# EAGLE design Timer-Ruler (EAGLE 7.5.0)
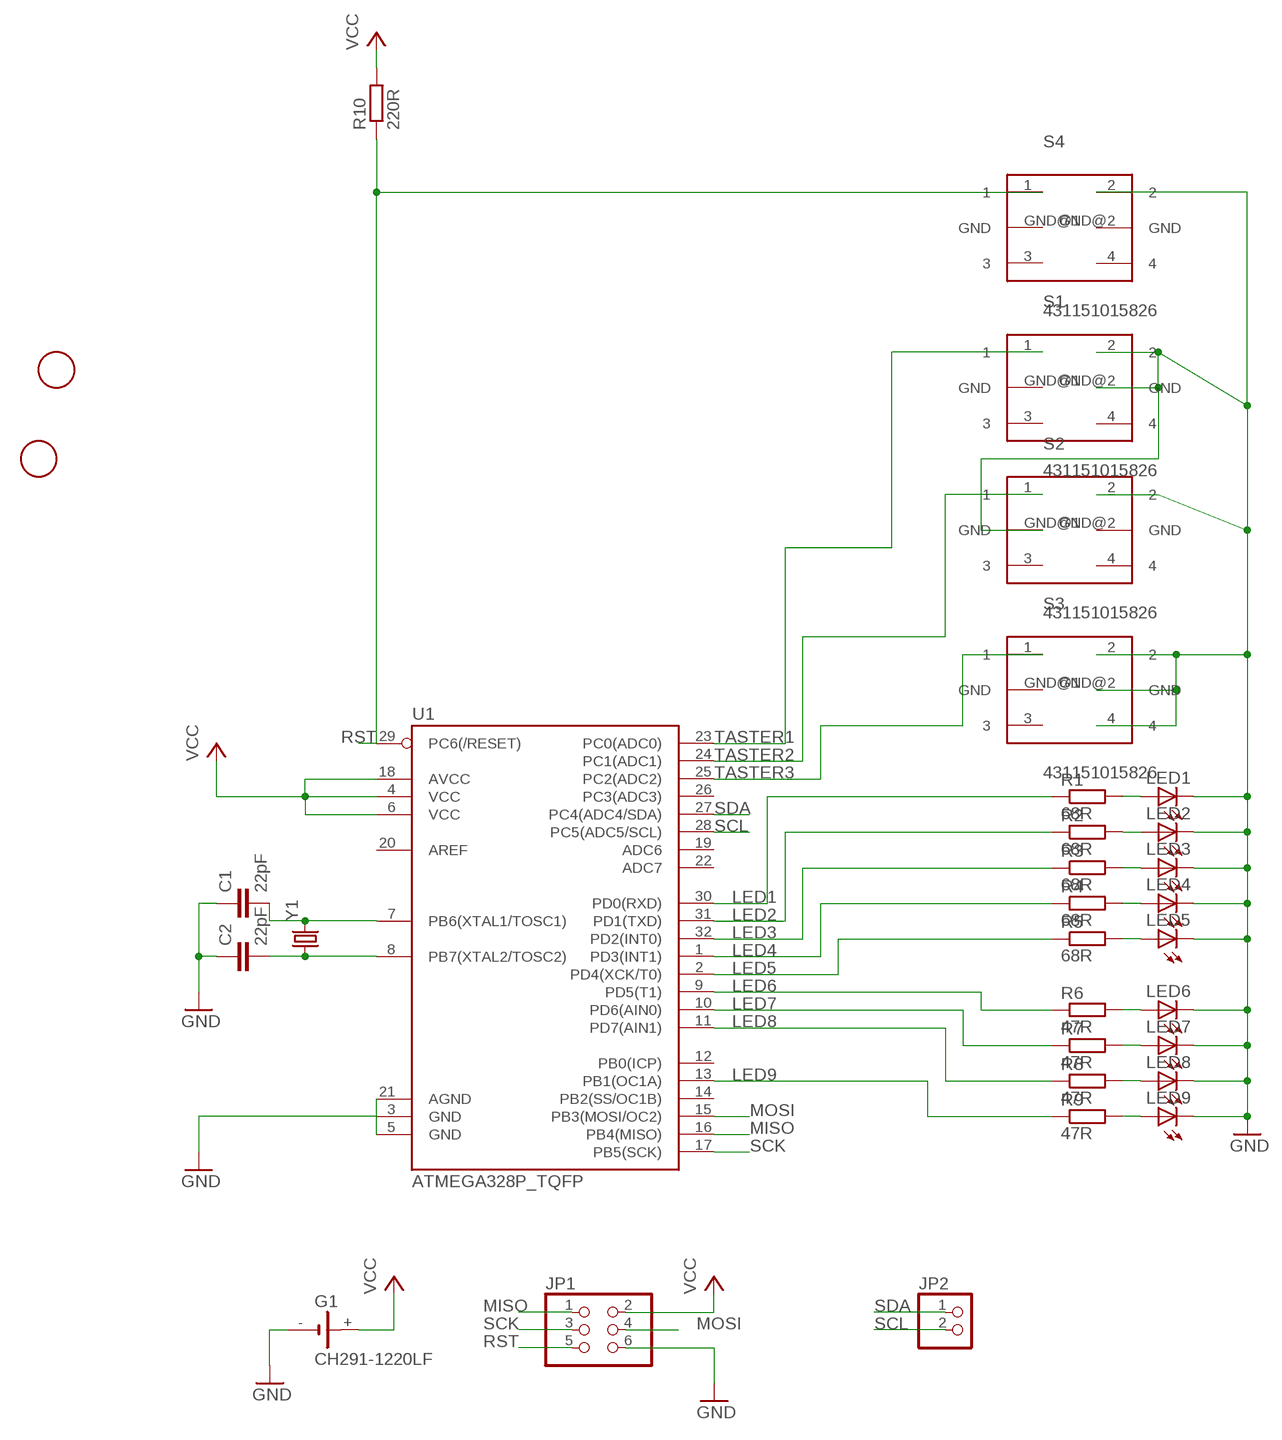
[diagram p0: schematic, sheet 1]

## Parts
C1  22pF  C-EUC0603  [C0603]
C2  22pF  C-EUC0603  [C0603]
G1  CH291-1220LF  [CH291-1220LF]
JP1  PINHD-2X3  [2X03]
JP2  PINHD-1X2  [1X02]
LED1  LEDCHIP-LED0805  [CHIP-LED0805]
LED2  LEDCHIP-LED0805  [CHIP-LED0805]
LED3  LEDCHIP-LED0805  [CHIP-LED0805]
LED4  LEDCHIP-LED0805  [CHIP-LED0805]
LED5  LEDCHIP-LED0805  [CHIP-LED0805]
LED6  LEDCHIP-LED0805  [CHIP-LED0805]
LED7  LEDCHIP-LED0805  [CHIP-LED0805]
LED8  LEDCHIP-LED0805  [CHIP-LED0805]
LED9  LEDCHIP-LED0805  [CHIP-LED0805]
R1  68R  R-EU_R0603  [R0603]
R2  68R  R-EU_R0603  [R0603]
R3  68R  R-EU_R0603  [R0603]
R4  68R  R-EU_R0603  [R0603]
R5  68R  R-EU_R0603  [R0603]
R6  47R  R-EU_R0603  [R0603]
R7  47R  R-EU_R0603  [R0603]
R8  47R  R-EU_R0603  [R0603]
R9  47R  R-EU_R0603  [R0603]
R10  220R  R-EU_R0603  [R0603]
S1  431151015826  [431181015816]
S2  431151015826  [431181015816]
S3  431151015826  [431181015816]
S4  431151015826  [431181015816]
U1  ATMEGA328P_TQFP  [TQFP32-08]
U$1  FIDUCIAL  [FIDUCIAL_1MM]
U$2  FIDUCIAL  [FIDUCIAL_1MM]
Y1  CRYSTALCRYSTAL-SMD-5X3-12.288MHZ  [CRYSTAL-SMD-5X3]

## Nets
GND: C1.1 C2.1 G1.- JP1.6 LED1.C LED2.C LED3.C LED4.C LED5.C LED6.C LED7.C LED8.C LED9.C S1.2 S1.GND@2(GND) S2.2 S2.GND@1(GND) S3.2 S3.4 S3.GND@2(GND) S4.2 U1.3(GND)
LED1: R1.1 U1.30(PD0(RXD))
LED2: R2.1 U1.31(PD1(TXD))
LED3: R3.1 U1.32(PD2(INT0))
LED4: R4.1 U1.1(PD3(INT1))
LED5: R5.1 U1.2(PD4(XCK/T0))
LED6: R6.1 U1.9(PD5(T1))
LED7: R7.1 U1.10(PD6(AIN0))
LED8: R8.1 U1.11(PD7(AIN1))
LED9: R9.1 U1.13(PB1(OC1A))
MISO: JP1.1 U1.16(PB4(MISO))
MOSI: JP1.4 U1.15(PB3(MOSI/OC2))
N$1: LED1.A R1.2
N$2: LED2.A R2.2
N$3: LED3.A R3.2
N$4: LED4.A R4.2
N$5: LED5.A R5.2
N$6: LED6.A R6.2
N$7: LED7.A R7.2
N$8: LED8.A R8.2
N$9: LED9.A R9.2
N$10: C1.2 U1.7(PB6(XTAL1/TOSC1)) Y1.3
N$12: C2.2 U1.8(PB7(XTAL2/TOSC2)) Y1.1
N$13: U1.5(GND) U1.21(AGND)
RST: JP1.5 R10.1 S4.1 U1.29(PC6(/RESET))
SCK: JP1.3 U1.17(PB5(SCK))
SCL: JP2.2 U1.28(PC5(ADC5/SCL))
SDA: JP2.1 U1.27(PC4(ADC4/SDA))
TASTER1: S1.1 U1.23(PC0(ADC0))
TASTER2: S2.1 U1.24(PC1(ADC1))
TASTER3: S3.1 U1.25(PC2(ADC2))
VCC: G1.+ JP1.2 R10.2 U1.4(VCC) U1.6(VCC) U1.18(AVCC)
Unconnected: S1.3 S1.4 S1.GND@1(GND) S2.3 S2.4 S2.GND@2(GND) S3.3 S3.GND@1(GND) S4.3 S4.4 S4.GND@1(GND) S4.GND@2(GND) U1.12(PB0(ICP)) U1.14(PB2(SS/OC1B)) U1.19(ADC6) U1.20(AREF) U1.22(ADC7) U1.26(PC3(ADC3))

## Library data of the parts
C1 C2 = resistor:C-EU: CAPACITOR, European symbol
G1 = battery:CH291-1220LF: Battery Holder, SMT, 12mm multicomp PART NO. CH291-1220LF Source: Data sheet <http://www.farnell.com/datasheets/1505860.pdf>
JP1 = pinhead:PINHD-2X3: PIN HEADER
JP2 = pinhead:PINHD-1X2: PIN HEADER
LED1-LED9 = led:LED: LED OSRAM: - CHIPLED LG R971, LG N971, LY N971, LG Q971, LY Q971, LO R971, LY R971 LH N974, LH R974 LS Q976, LO Q976, LY Q976 LO Q996 - Hyper CHIPLED LW Q18S LB Q993, LB Q99A, LB R99A - SideLED LS A670, LO A670, LY A670, LG A670, LP A670 LB A673, LV A673, LT A673, LW A673 LH A674 LY A675 LS A676, LA A676, LO A676, LY A676, LW A676 LS A679, LY A679, LG A679 - Hyper Micro SIDELED® LS Y876, LA Y876, LO Y876, LY Y876 LT Y87S - SmartLED LW L88C, LW L88S LB L89C, LB L89S, LG L890 LS L89K, LO L89K, LY L89K LS L896, LA L896, LO L896, LY L896 - TOPLED LS T670, LO T670, LY T670, LG T670, LP T670 LSG T670, LSP T670, LSY T670, LOP T670, LYG T670 LG T671, LOG T671, LSG T671 LB T673, LV T673, LT T673, LW T673 LH T674 LS T676, LA T676, LO T676, LY T676, LB T676, LH T676, LSB T676, LW T676 LB T67C, LV T67C, LT T67C, LS T67K, LO T67K, LY T67K, LW E67C LS E67B, LA E67B, LO E67B, LY E67B, LB E67C, LV E67C, LT E67C LW T67C LS T679, LY T679, LG T679 LS T770, LO T770, LY T770, LG T770, LP T770 LB T773, LV T773, LT T773, LW T773 LH T774 LS E675, LA E675, LY E675, LS T675 LS T776, LA T776, LO T776, LY T776, LB T776 LHGB T686 LT T68C, LB T68C - Hyper Mini TOPLED® LB M676 - Mini TOPLED Santana® LG M470 LS M47K, LO M47K, LY M47K Source: http://www.osram.convergy.de LUXEON: - LUMILED® LXK2-PW12-R00, LXK2-PW12-S00, LXK2-PW14-U00, LXK2-PW14-V00 LXK2-PM12-R00, LXK2-PM12-S00, LXK2-PM14-U00 LXK2-PE12-Q00, LXK2-PE12-R00, LXK2-PE12-S00, LXK2-PE14-T00, LXK2-PE14-U00 LXK2-PB12-K00, LXK2-PB12-L00, LXK2-PB12-M00, LXK2-PB14-N00, LXK2-PB14-P00, LXK2-PB14-Q00 LXK2-PR12-L00, LXK2-PR12-M00, LXK2-PR14-Q00, LXK2-PR14-R00 LXK2-PD12-Q00, LXK2-PD12-R00, LXK2-PD12-S00 LXK2-PH12-R00, LXK2-PH12-S00 LXK2-PL12-P00, LXK2-PL12-Q00, LXK2-PL12-R00 Source: www.luxeon.com KINGBRIGHT: KA-3528ASYC Source: www.kingbright.com
R1-R10 = resistor:R-EU_: RESISTOR, European symbol
S1-S4 = Wurth_Elektronik_Electromechanic_Switchs_rev15b:431151015826: WS-TSS-5x5 mm SMD Tact Switch with ground terminal, 4 pins
U1 = SparkFun-DigitalIC:ATMEGA328P_TQFP; PROD_ID: IC-09069
U$1 U$2 = adafruit:FIDUCIAL: For use by pick and place machines to calibrate the vision/machine, 1mm By microbuilder.eu
Y1 = SparkFun-FreqCtrl:CRYSTAL: Various standard crystals. Proven footprints.; PROD_ID: XTAL-09653

## Board
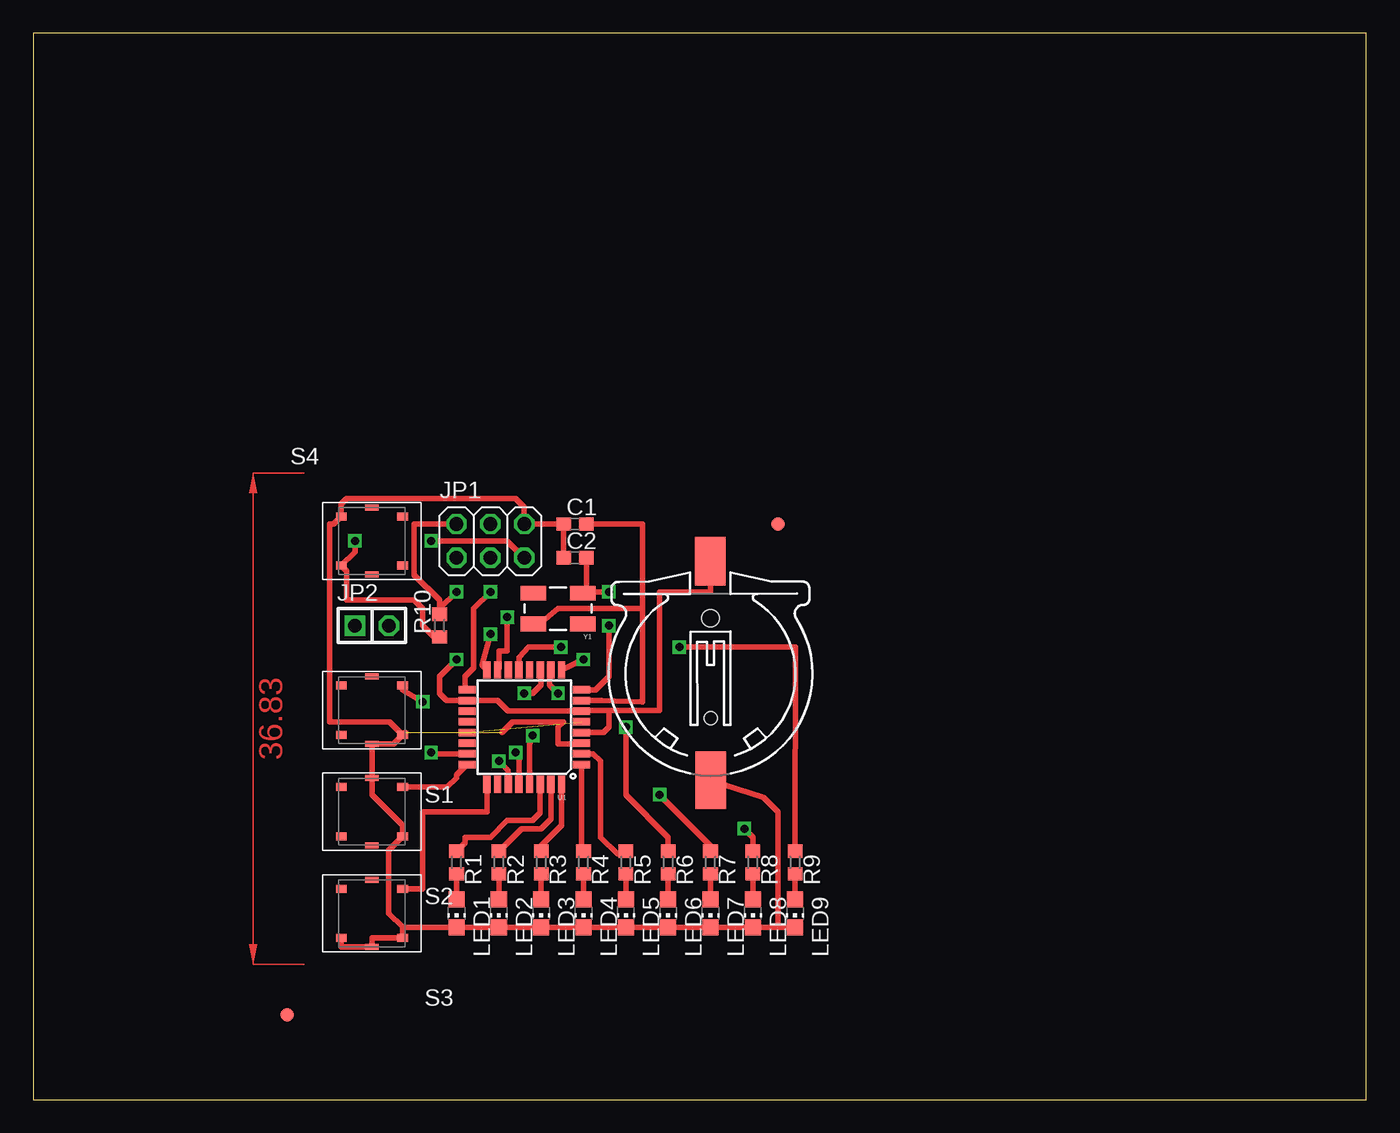
[diagram p1: board, top side]
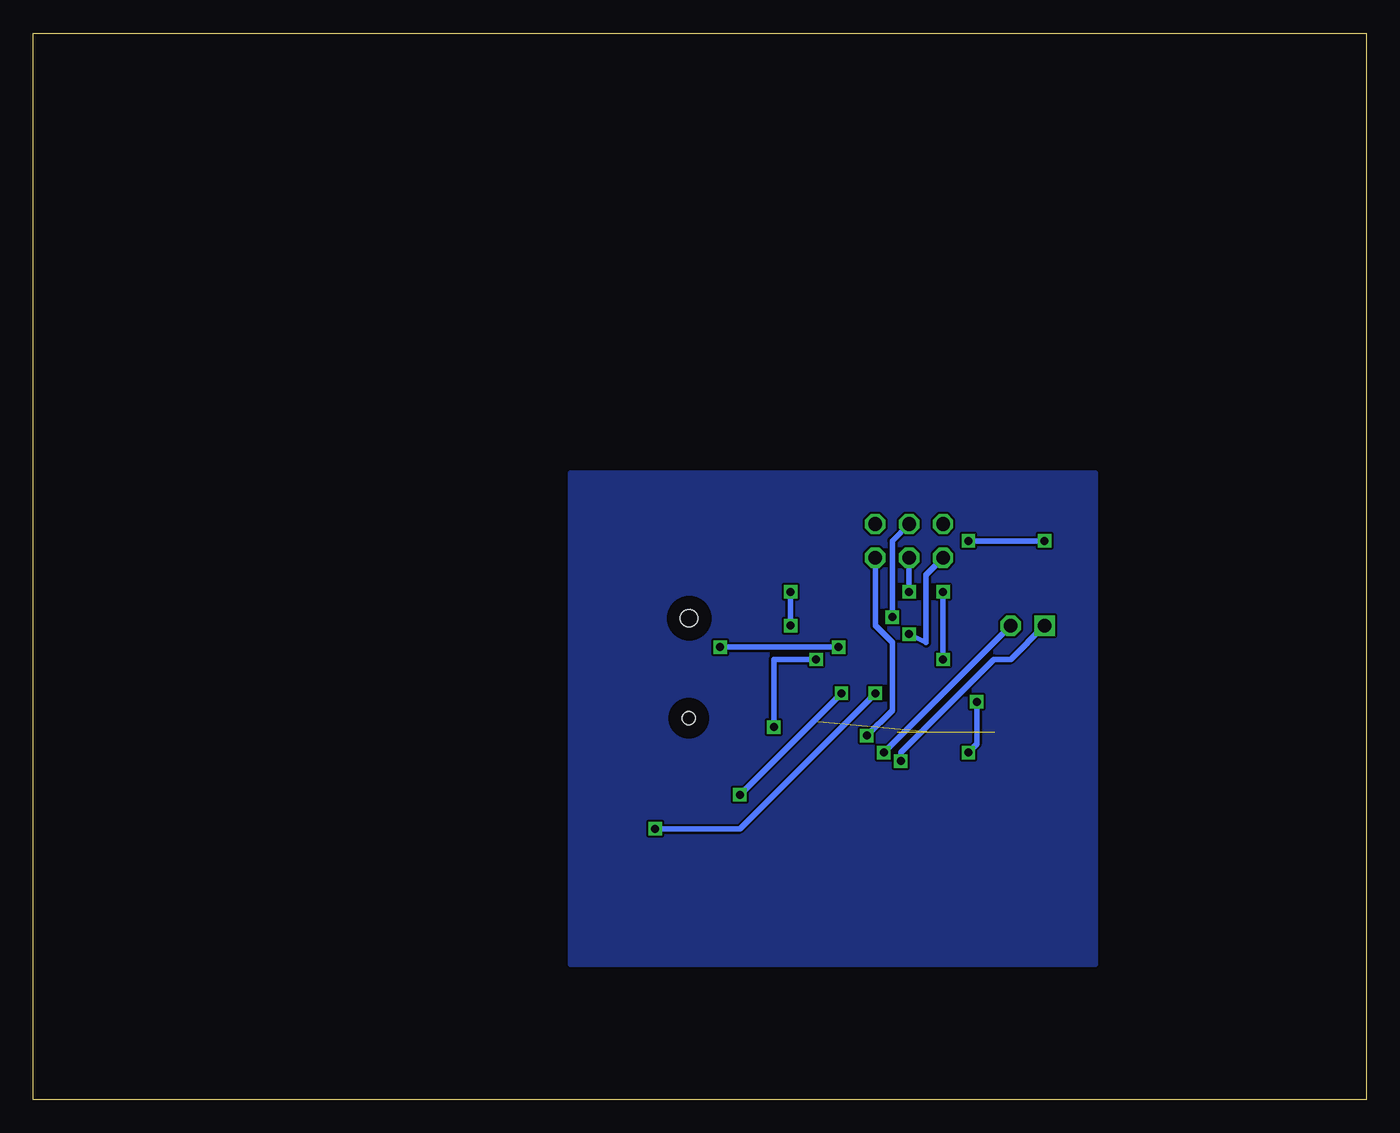
[diagram p2: board, bottom side, seen from below]

Size 100 x 80 mm. Coordinates in mm from the lower left corner, seen from the top.
Outline: 0,0 100,0 100,80 0,80 0,0
Copper layers (1*16): Top 0.035mm / dielectric 1.5mm / Bottom 0.035mm
Design rules "default *": minimum track width 0.4mm, minimum drill 0.4mm, track to track 7mil, track to pad 7mil, pad to pad 7mil, via to via 7mil, smd to smd 7mil, copper to edge 40mil, drill to drill 8mil, minimum pad ring 10mil, minimum via ring 8mil, stop-mask expansion 4mil, vias tented up to drill 0mil, thermal gap 10mil

### Footprints (pad centres in the part's own frame; a part is rotated, then mirrored left to right if it is on the bottom)
C0603 = smd 1.1 x 1: 1 -0.85,0; 2 0.85,0
CH291-1220LF = smd 2.3 x 3.66: + 0,-2.296 | smd 2.3 x 4.3: - 0,14.146 | hole 1.3: 0,2 | hole 1: 0,9.5
2X03 = drill 1.016 octagon: 1 -2.54,-1.27; 2 -2.54,1.27; 3 0,-1.27; 4 0,1.27; 5 2.54,-1.27; 6 2.54,1.27
1X02 = drill 1.016 square: 1 -1.27,0 | drill 1.016 octagon: 2 1.27,0
CHIP-LED0805 = smd 1.2 x 1.2: A 0,-1.05; C 0,1.05
R0603 = smd 1 x 1.1: 1 -0.85,0; 2 0.85,0
431181015816 = smd 0.8 x 0.6: 1 -2.3,-1.85; 2 -2.3,1.85; 3 2.3,-1.85; 4 2.3,1.85 | smd 1 x 0.45: GND@1 0,-2.525; GND@2 0,2.525
TQFP32-08 = smd 1.27 x 0.559: 1 -4.293,2.8; 2 -4.293,2; 3 -4.293,1.2; 4 -4.293,0.4; 5 -4.293,-0.4; 6 -4.293,-1.2; 7 -4.293,-2; 8 -4.293,-2.8; 17 4.293,-2.8; 18 4.293,-2; 19 4.293,-1.2; 20 4.293,-0.4; 21 4.293,0.4; 22 4.293,1.2; 23 4.293,2; 24 4.293,2.8 | smd 0.559 x 1.27: 9 -2.8,-4.293; 10 -2,-4.293; 11 -1.2,-4.293; 12 -0.4,-4.293; 13 0.4,-4.293; 14 1.2,-4.293; 15 2,-4.293; 16 2.8,-4.293; 25 2.8,4.293; 26 2,4.293; 27 1.2,4.293; 28 0.4,4.293; 29 -0.4,4.293; 30 -1.2,4.293; 31 -2,4.293; 32 -2.8,4.293
FIDUCIAL_1MM = smd 1 x 1: 1 0,0
CRYSTAL-SMD-5X3 = smd 1.9 x 1.1: 1 -1.85,-1.15; 2 1.85,-1.15; 3 1.85,1.15; 4 -1.85,1.15

### Placement (x,y rotation side)
C1  40.64,43.18 0 top
C2  40.64,40.64 0 top
G1  50.8,38.1 180.1 top
JP1  34.29,41.91 0 top
JP2  25.4,35.56 0 top
LED1  31.75,13.97 180 top
LED2  34.92,13.97 180 top
LED3  38.1,13.97 180 top
LED4  41.27,13.97 180 top
LED5  44.45,13.97 180 top
LED6  47.62,13.97 180 top
LED7  50.8,13.97 180 top
LED8  53.98,13.97 180 top
LED9  57.15,13.97 180 top
R1  31.75,17.78 270 top
R2  34.92,17.78 270 top
R3  38.1,17.78 270 top
R4  41.27,17.78 270 top
R5  44.45,17.78 270 top
R6  47.62,17.78 270 top
R7  50.8,17.78 270 top
R8  53.98,17.78 270 top
R9  57.15,17.78 270 top
R10  30.48,35.56 90 top
S1  25.4,29.21 180 top
S2  25.4,21.59 180 top
S3  25.4,13.97 180 top
S4  25.4,41.91 0 top
U1  36.83,27.94 180 top
U$1  55.88,43.18 0 top
U$2  19.05,6.35 0 top
Y1  39.37,36.83 180 top

### Tracks (layer width: path | path; a pad name or v marks a point on that pad's centre or on a via)
GND  (1 unrouted)
  Top 0.406: LED2.C LED3.C LED4.C | 55.88,12.92 LED9.C | LED4.C LED2.C | 27.7,12.92 LED1.C LED2.C | 27.7,12.92 S3.2 25.4,12.12 S3.GND@2 23.1,11.45 S3.4 | S1.2 27.02,26.68 S1.GND@2 S2.GND@1 25.4,22.86 27.7,20.56 S2.2 26.67,18.71 26.67,13.97 27.7,12.94 27.7,12.92 | 35.16,27.54 35.96,28.34 39.77,28.34 39.37,27.94 39.37,26.67 41.05,26.67 U1.3 | 27.88,27.54 S1.2 | C2.1 C1.1 JP1.6 36.83,44.45 36.2,45.09 23.5,45.09 23.1,44.69 S4.2 22.52,43.18 22.23,43.18 22.23,28.34 26.72,28.34 S1.2 | G1.- 54.79,22.68 55.88,21.59 55.88,12.92 | 55.88,12.92 LED8.C LED7.C LED6.C LED5.C LED4.C
LED1
  Top 0.406: U1.30 38.03,21.52 37.47,20.95 35.56,20.95 34.29,19.68 32.38,19.68 32.38,19.27 R1.1
LED2
  Top 0.406: U1.31 38.83,21.05 38.1,20.32 36.62,20.32 R2.1
LED3
  Top 0.406: U1.32 39.63,20.58 38.1,19.05 R3.1
LED4
  Top 0.406: U1.1 41.12,18.78 R4.1
LED5
  Top 0.406: U1.2 42.01,25.94 42.55,25.4 42.55,19.68 43.81,18.41 44.23,18.41 R5.1
LED6  (via drill 0.6)
  Top 0.406: R6.1 47.62,19.68 44.45,22.86 v44.45,27.94 | v41.27,33.02 U1.9
  Bottom 0.406: v44.45,27.94 44.45,33.02 v41.27,33.02
LED7  (via drill 0.6)
  Top 0.406: R7.1 50.8,19.05 v46.99,22.86 | U1.10 38.73,32.14 38.73,31.11 v39.37,30.48
  Bottom 0.406: v46.99,22.86 v39.37,30.48
LED8  (via drill 0.6)
  Top 0.406: R8.1 53.98,19.68 v53.34,20.32 | v36.83,30.48 37.47,30.48 38.1,31.11 38.1,32.16 U1.11
  Bottom 0.406: v53.34,20.32 46.99,20.32 v36.83,30.48
LED9  (via drill 0.6)
  Top 0.406: R9.1 57.19,33.96 v48.47,33.95 | v39.58,33.95 37.16,33.96 36.45,33.16 36.45,32.25 U1.13
  Bottom 0.406: v48.47,33.95 v39.58,33.95
MISO  (via drill 0.6)
  Top 0.406: v34.29,34.92 33.66,32.61 U1.16
  Bottom 0.406: JP1.1 33.02,39.37 33.02,34.29 v34.29,34.92
MOSI  (via drill 0.6)
  Top 0.406: v35.56,36.2 35.56,34.29 35.56,33.66 34.92,33.66 34.92,32.33 U1.15
  Bottom 0.406: JP1.4 35.56,41.91 v35.56,36.2
N$1
  Top 0.406: R1.2 LED1.A
N$2
  Top 0.406: R2.2 LED2.A
N$3
  Top 0.406: R3.2 LED3.A
N$4
  Top 0.406: R4.2 LED4.A
N$5
  Top 0.406: R5.2 LED5.A
N$6
  Top 0.406: R6.2 LED6.A
N$7
  Top 0.406: R7.2 LED7.A
N$8
  Top 0.406: R8.2 LED8.A
N$9
  Top 0.406: R9.2 LED9.A
N$10
  Top 0.406: C1.2 45.72,43.18 45.72,36.83 | 45.72,36.83 45.72,29.84 42.64,29.94 U1.7 | Y1.3 37.98,35.68 39.37,36.83 45.72,36.83
N$11
  pour Bottom: 20.32,46.99 59.69,46.99 59.69,10.16 20.32,10.16
N$12  (via drill 0.6)
  Top 0.406: C2.2 41.49,38.25 Y1.1 41.34,38.1 v43.18,38.1 | U1.8 42.17,30.74 43.18,31.75 v43.18,35.56
  Bottom 0.406: v43.18,35.56 v43.18,38.1
N$13  (1 unrouted)
RST  (via drill 0.6)
  Top 0.406: R10.1 30.06,34.71 29.21,35.56 29.21,36.83 28.57,37.47 23.5,37.47 23.5,39.66 S4.1 24.13,41.09 v24.13,41.91 | JP1.5 35.56,41.91 v29.84,41.91 | U1.29 37.23,26.67 v37.47,27.3
  Bottom 0.406: v37.47,27.3 35.56,29.21 35.56,34.29 36.83,35.56 JP1.5 | v29.84,41.91 v24.13,41.91
SCK  (via drill 0.6)
  Top 0.406: v34.29,38.1 33.02,36.83 33.02,32.38 32.38,31.75 32.38,30.89 U1.17
  Bottom 0.406: JP1.3 v34.29,38.1
SCL  (via drill 0.6)
  Top 0.406: U1.28 36.43,25.8 v36.2,26.04
  Bottom 0.406: v36.2,26.04 JP2.2
SDA  (via drill 0.6)
  Top 0.406: U1.27 35.63,24.7 v34.92,25.4
  Bottom 0.406: v34.92,25.4 34.92,26.04 27.94,33.02 26.67,33.02 JP2.1
TASTER1  (via drill 0.6)
  Top 0.406: S1.1 27.7,30.72 v29.21,29.84 | U1.23 29.94,25.94 v29.84,26.04
  Bottom 0.406: v29.21,29.84 29.21,26.67 v29.84,26.04
TASTER2
  Top 0.406: S2.1 31.06,23.44 31.75,24.13 31.75,24.35 U1.24
TASTER3
  Top 0.406: S3.1 29.21,15.82 29.21,21.59 34.03,21.59 U1.25
VCC  (via drill 0.6)
  Top 0.406: G1.+ 50.8,38.1 46.99,38.1 46.99,29.21 43.18,29.21 | 43.18,29.21 41.19,29.21 U1.6 35.63,29.14 34.83,29.94 U1.18 31.02,29.94 30.48,30.48 30.48,31.75 v31.75,33.02 | JP1.2 28.57,43.18 28.57,39.37 30.48,37.47 R10.2 30.48,36.83 v31.75,38.1 | U1.4 42.78,27.54 43.18,27.94 43.18,29.21
  Bottom 0.406: v31.75,38.1 v31.75,33.02
(copper drawn outside any net)
  shapes: Top area x1